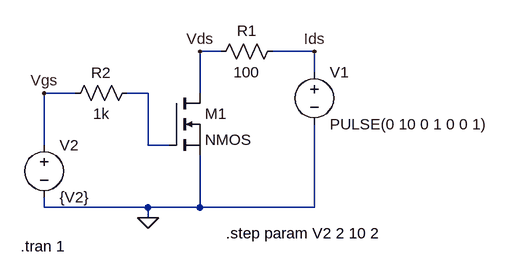
[diagram p0: schematic NMOS diff vgs.asc]
NMOS diff vgs.asc, the LTspice schematic file:
Version 4
SHEET 1 880 680
WIRE 208 48 176 48
WIRE 352 48 288 48
WIRE 352 80 352 48
WIRE -16 112 -64 112
WIRE 96 112 64 112
WIRE 176 112 176 48
WIRE -64 192 -64 112
WIRE 96 192 96 112
WIRE 128 192 96 192
WIRE -64 288 -64 272
WIRE 96 288 -64 288
WIRE 176 288 176 208
WIRE 176 288 96 288
WIRE 352 288 352 160
WIRE 352 288 176 288
WIRE 96 304 96 288
FLAG 96 304 0
FLAG 176 48 Vds
FLAG 352 48 Ids
FLAG -64 112 Vgs
SYMBOL nmos 128 112 R0
SYMATTR InstName M1
SYMBOL voltage 352 64 R0
WINDOW 123 0 0 Left 0
WINDOW 39 0 0 Left 0
SYMATTR InstName V1
SYMATTR Value PULSE(0 10 0 1 0 0 1)
SYMBOL voltage -64 176 R0
WINDOW 123 0 0 Left 0
WINDOW 39 0 0 Left 0
SYMATTR InstName V2
SYMATTR Value {V2}
SYMBOL res 304 32 R90
WINDOW 0 0 56 VBottom 2
WINDOW 3 32 56 VTop 2
SYMATTR InstName R1
SYMATTR Value 100
SYMBOL res 80 96 R90
WINDOW 0 0 56 VBottom 2
WINDOW 3 32 56 VTop 2
SYMATTR InstName R2
SYMATTR Value 1k
TEXT 216 328 Left 2 !.step param V2 2 10 2
TEXT -100 348 Left 2 !.tran 1

The netlist it stands for:
* NMOS diff vgs.asc
M1 Vds N001 0 0 NMOS
V1 Ids 0 PULSE(0 10 0 1 0 0 1)
V2 Vgs 0 {V2}
R1 Ids Vds 100
R2 N001 Vgs 1k
.model NMOS NMOS
.model PMOS PMOS
.lib standard.mos
.step param V2 2 10 2
.tran 1
.backanno
.end